# Altium project Breakout_4pin.PrjPcb
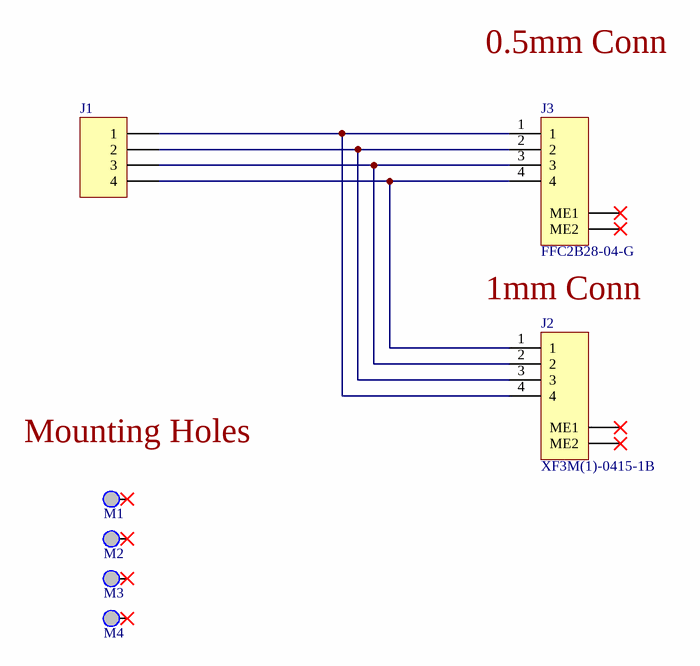
[diagram p0: Main.SchDoc]
ProjectName: Breakout_4pin; Rev: A
1 sheet, 7 parts. Net scope: global (net labels, ports and power ports of the same name join across sheets).
Board file: Breakout_4pin.PcbDoc

## Sheet Main.SchDoc: Breakout 4pin
size A3; Organization: INTERCREATE; Address1: 2415 3RD ST. SUITE #232; Address2: SAN FRANCISCO CA 94107; Revision: A; SheetNumber: 1; SheetTotal: 1; ProjectName: KAGWERKS COMMAND CENTER

### Parts
J1  61300411121  [HDR-V-1X4]  (value not drawn)
J2  XF3M(1)-0415-1B  [CONN-FFC-H-4P-1MM]
J3  FFC2B28-04-G  [CONN-FFC-H-4P-0.5MM]
M1  MTG_HOLE  [MH_P_2.5MM]  (value not drawn)  (no BOM)
M2  MTG_HOLE  [MH_P_2.5MM]  (value not drawn)  (no BOM)
M3  MTG_HOLE  [MH_P_2.5MM]  (value not drawn)  (no BOM)
M4  MTG_HOLE  [MH_P_2.5MM]  (value not drawn)  (no BOM)

### Nets
NetJ1_1: J1.1 J2.4 J3.1
NetJ1_2: J1.2 J2.3 J3.2
NetJ1_3: J1.3 J2.2 J3.3
NetJ1_4: J1.4 J2.1 J3.4

Not connected (* = marked no-connect by the designer): J2 ME1* ME2*; J3 ME1* ME2*; M1 1*; M2 1*; M3 1*; M4 1*

### Notes on the sheet
- 0.5mm Conn
- 1mm Conn
- (near M1) Mounting Holes
- Title
- Size:
- Date:
- A3
- Number:
- Time:
- Revision:
- Sheet
- of
- File:

### Library data of the parts
J1 = HDR-V-1X4-M: Header, 4-Pin, 0.1"; Manufacturer 1: Wurth Electronics; Number of Positions: 4; Gender: Male; Connector Type: Male Pin; Pitch: 0.1inch; ComponentLink1URL: http://www.farnell.com/cad/1737268.pdf; ComponentLink1Description: http://www.farnell.com/cad/1737268.pdf; ComponentLink2URL: http://katalog.we-online.de/em/datasheet/6130xx11121.pdf; ComponentLink2Description: http://katalog.we-online.de/em/datasheet/6130xx11121.pdf; Supplier 1: Digi-Key; Manufacturer Part Number 1: 61300411121; Stock 1: 25747; Pricing 1: 1=0.18000, 10=0.15300, 25=0.12720, 50=0.10600, 100=0.09600, 1000=0.08800 (USD); RoHS: Yes; Mount: Through Hole; Contact Plating: Gold; Contact Material: Copper; Color: Black; Number of Rows: 1; Packaging: Bulk; Termination: Solder; Number of Contacts: 4; Contact Mating Length: 0.236inch; REACH SVHC: Unknown; Lead Free: Lead Free; ComponentLink3URL: http://www.farnell.com/cad/1737268.pdf?src-supplier=Element14; ComponentLink3Description: http://www.farnell.com/cad/1737268.pdf?src-supplier=Element14; ComponentLink4URL: https://katalog.we-online.de/em/datasheet/6130xx11121.pdf?src-supplier=Digi-Key; ComponentLink4Description: https://katalog.we-online.de/em/datasheet/6130xx11121.pdf?src-supplier=Digi-Key; Supplier Part Number 1: 732-5317-ND
J2 = CONN-FFC-H-4P-1MM: FFC & FPC Connectors RotaryBackLock 1.0mm Dual Contact 4pin; Manufacturer 1: Omron; Actuator Material: Polymer,Liquid Crystal Polymer; Actuator Color: Black; Gender: Female; Current Rating: 500mA; Number of Contacts: 4; Voltage Rating: 50V; Insulation Resistance: 100MR; Mating Cycles: 20; Pitch: 1mm; Supplier 1: Arrow Electronics; Manufacturer Part Number 1: XF3M(1)-0415-1B; RoHS: Yes; Category: FFC / FPC; Stock 1: 10500; Pricing 1: 1500=0.6934, 3000=0.542, 6000=0.5365, 12000=0.5311, 15000=0.5257, 24000=0.5204, 30000=0.5152 (USD); Mounting Technology: Surface Mount; Contact Material: Copper Alloy; Contact Plating: Gold; Housing Material: Polymer; Housing Color: Natural; Min Operating Temperature: -30°C; Max Operating Temperature: 85°C; Number of Rows: 1; Termination: Solder; Orientation: Right Angle; Series: XF3M; Packaging: Tape and Reel; Package Quantity: 1; Number of Positions: 4; Contact Location: Dual; Radiation Hardening: No; RoHS Compliant: Yes; Lead Free: Lead Free; Flammability Rating: UL94 V-0; ComponentLink1URL: https://datasheet.ciiva.com/29758/xf3m-0813-29758592.pdf?src-supplier=Digi-Key; ComponentLink1Description: https://datasheet.ciiva.com/29758/xf3m-0813-29758592.pdf?src-supplier=Digi-Key; ComponentLink2URL: https://datasheet.ciiva.com/29758/xf3m-0813-29758601.pdf?src-supplier=Digi-Key; ComponentLink2Description: https://datasheet.ciiva.com/29758/xf3m-0813-29758601.pdf?src-supplier=Digi-Key; ComponentLink3URL: https://datasheet.ciiva.com/43511/xf3m-0813-43511125.pdf?src-supplier=Onlinecomponents.com; ComponentLink3Description: https://datasheet.ciiva.com/43511/xf3m-0813-43511125.pdf?src-supplier=Onlinecomponents.com; Supplier Part Number 1: XF3M(1)-0415-1B
J3 = CONN-FFC-H-4P-0.5MM: 4W, 0.5MM Ffc Con, R/a, Dual Cont; Manufacturer 1: Global Connector Technology; Supplier 1: Newark; Manufacturer Part Number 1: FFC2B28-04-G; RoHS: No; Category: Connectors; Stock 1: 4000; Pricing 1: 4000=0.276, 5000=0.253 (USD); Supplier Part Number 1: 90AJ6003
M1-M4 = MTG_HOLE: MTG HOLE PLATED VARIOUS SIZES

## Assembly variants
Mfg: not fitted J1